# Altium project TestServoCircuit.PrjPcb
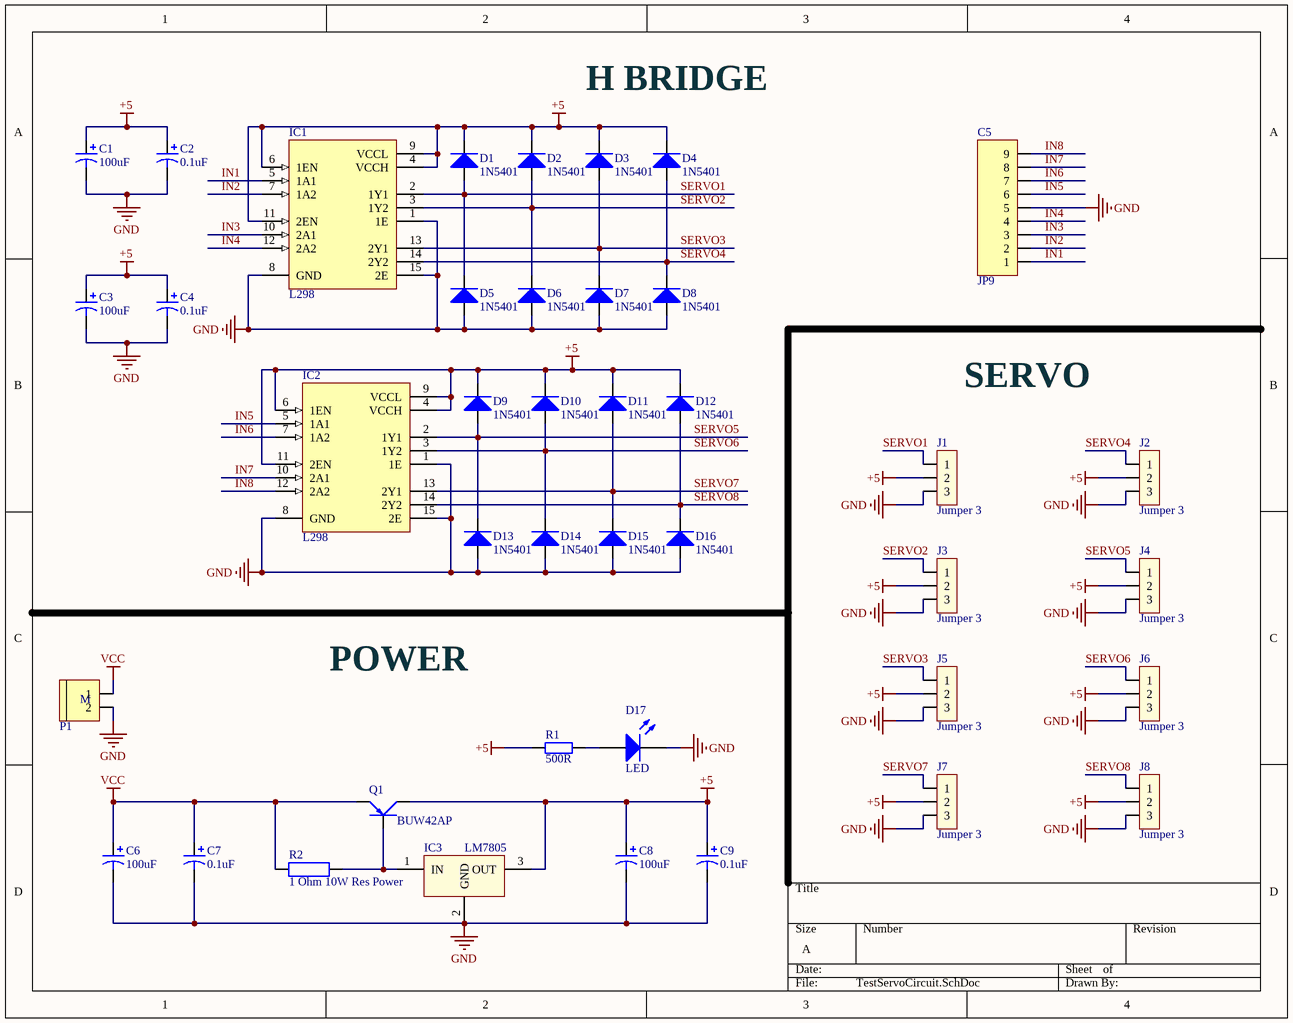
[diagram p0: TestServoCircuit.SchDoc]
1 sheet, 41 parts. Net scope: global (net labels, ports and power ports of the same name join across sheets).
Board file: TestServoCircuit.PcbDoc

## Sheet TestServoCircuit.SchDoc
size A; SheetNumber: 1; SheetTotal: 1

### Parts
C1  value 100uF  [CAPPR3-8x12]  (hidden comment: Cap Polar)
C2  value 0.1uF  [CAPPR2-5x11]  (hidden comment: Cap Polar)
C3  value 100uF  [CAPPR3-8x12]  (hidden comment: Cap Polar)
C4  value 0.1uF  [CAPPR2-5x11]  (hidden comment: Cap Polar)
C5  JP9  [JP9-D1T]
C6  value 100uF  [CAPPR3-8x12]  (hidden comment: Cap Polar)
C7  value 0.1uF  [CAPPR2-5x11]  (hidden comment: Cap Polar)
C8  value 100uF  [CAPPR3-8x12]  (hidden comment: Cap Polar)
C9  value 0.1uF  [CAPPR2-5x11]  (hidden comment: Cap Polar)
D1  1N5401  [DIODE/POW/3A]
D2  1N5401  [DIODE/POW/3A]
D3  1N5401  [DIODE/POW/3A]
D4  1N5401  [DIODE/POW/3A]
D5  1N5401  [DIODE/POW/3A]
D6  1N5401  [DIODE/POW/3A]
D7  1N5401  [DIODE/POW/3A]
D8  1N5401  [DIODE/POW/3A]
D9  1N5401  [DIODE/POW/3A]
D10  1N5401  [DIODE/POW/3A]
D11  1N5401  [DIODE/POW/3A]
D12  1N5401  [DIODE/POW/3A]
D13  1N5401  [DIODE/POW/3A]
D14  1N5401  [DIODE/POW/3A]
D15  1N5401  [DIODE/POW/3A]
D16  1N5401  [DIODE/POW/3A]
D17  LED  [LED_5mm]
IC1  L298  [DIP15SL2]
IC2  L298  [DIP15SL2]
IC3  LM7805  [QTO-220]
J1  Jumper 3  [JP3]
J2  Jumper 3  [JP3]
J3  Jumper 3  [JP3]
J4  Jumper 3  [JP3]
J5  Jumper 3  [JP3]
J6  Jumper 3  [JP3]
J7  Jumper 3  [JP3]
J8  Jumper 3  [JP3]
P1  KF301 Domino 2  [Header 2 - M]  (value not drawn)
Q1  BUW42AP  [TO-3P]
R1  value 500R  [DIEN TRO 1/4 W]  (hidden comment: R0.4W)
R2  1 Ohm 10W Res Power  [DIEN TRO 10W]

### Nets
+5: C1.1 C2.1 C3.1 C4.1 C8.1 C9.1 D1.2(K) D2.2(K) D3.2(K) D4.2(K) D9.2(K) D10.2(K) D11.2(K) D12.2(K) IC1.4(VCCH) IC1.6(1EN) IC1.9(VCCL) IC1.11(2EN) IC2.4(VCCH) IC2.6(1EN) IC2.9(VCCL) IC2.11(2EN) IC3.3(OUT) J1.2 J2.2 J3.2 J4.2 J5.2 J6.2 J7.2 J8.2 Q1.2(C) R1.1
GND: C1.2 C2.2 C3.2 C4.2 C5.5 C6.2 C7.2 C8.2 C9.2 D5.1(A) D6.1(A) D7.1(A) D8.1(A) D13.1(A) D14.1(A) D15.1(A) D16.1(A) D17.2(K) IC1.1(1E) IC1.8(GND) IC1.15(2E) IC2.1(1E) IC2.8(GND) IC2.15(2E) IC3.2(GND) J1.3 J2.3 J3.3 J4.3 J5.3 J6.3 J7.3 J8.3 P1.2
VCC: C6.1 C7.1 P1.1 Q1.3(E) R2.1
IN1: C5.1 IC1.5(1A1)
IN2: C5.2 IC1.7(1A2)
IN3: C5.3 IC1.10(2A1)
IN4: C5.4 IC1.12(2A2)
IN5: C5.6 IC2.5(1A1)
IN6: C5.7 IC2.7(1A2)
IN7: C5.8 IC2.10(2A1)
IN8: C5.9 IC2.12(2A2)
SERVO1: D1.1(A) D5.2(K) IC1.2(1Y1) J1.1
SERVO2: D2.1(A) D6.2(K) IC1.3(1Y2) J3.1
SERVO3: D3.1(A) D7.2(K) IC1.13(2Y1) J5.1
SERVO4: D4.1(A) D8.2(K) IC1.14(2Y2) J2.1
SERVO5: D9.1(A) D13.2(K) IC2.2(1Y1) J4.1
SERVO6: D10.1(A) D14.2(K) IC2.3(1Y2) J6.1
SERVO7: D11.1(A) D15.2(K) IC2.13(2Y1) J7.1
SERVO8: D12.1(A) D16.2(K) IC2.14(2Y2) J8.1
NetD17_1: D17.1(A) R1.2
NetIC3_1: IC3.1(IN) Q1.1(B) R2.2

### Notes on the sheet
- H BRIDGE
- SERVO
- POWER
- (in symbol HEADER 2 - M) M

### Library data of the parts
C1-C4 C6-C9 = Cap Polar: Polarized Capacitor; Published: 8-Jun-2000; LatestRevisionDate: 17-Jul-2002; LatestRevisionNote: Re-released for DXP Platform.; PackageReference: POLAR0.8; Publisher: Altium Limited
C5 = JP9: WR-PHD 2.54 mm Angled Socket Header; Manufacturer: W¨¹rth Elektronik eiSos GmbH; partNo: 613009143121; ComponentLink1 Description: Manufacturer; ComponentLink2 Description: Datasheet; NoPins: 09; Created Date: 29 March 2013; ComponentLink1URL: http://www.we-online.com; ComponentLink2URL: http://katalog.we-online.de/em/datasheet/6130xx143121.pdf; Created by: Karrer Zheng
D1-D16 = Diode: Default Diode; Published: 8-Jun-2000; LatestRevisionDate: 17-Jul-2002; LatestRevisionNote: Re-released for DXP Platform.; PackageVersion: Sep-1996; PackageReference: SMC; Publisher: Altium Limited; Code_JEDEC: DO-214-AB
D17 = LED: Typical INFRARED GaAs LED; Published: 8-Jun-2000; LatestRevisionDate: 08-Jul-2005; LatestRevisionNote: Mech Layer 1 removed.; PackageReference: LED-0; Publisher: Altium Limited
IC1 IC2 = L298: Dual Full-H Driver; Note: The tab is elec is connected to GND pin; Published: 15-May-2002; DatasheetVersion: Jun-1990; PackageReference: KV015; Publisher: Altium Limited; PackageDescription: TO, Thru-Hole, Vertical, Heatsink Mounted; 15 Bent Staggered Leads; Pitch 1.27 mm; ComponentLink1Description: Manufacturer Link; ComponentLink1URL: http://www.ti.com/
IC3 = LM78xx: On ap +, from + 5 to + 24VDC; Value: LM7805
J1-J8 = JP3: Value: J3
P1 = HEADER 2 - M: TERM BLOCK PLUG 2POS 5MM; Manufacturer: On-Shore Technology; Number of Positions: 2; Number of Levels: 1; Current: 10A; Voltage: 300V; Pitch: 0.197inch; Wire Gauge (Max): 22AWG; Wire Gauge (Min): 14AWG; Supplier 1: Digi-Key; Manufacturer Part Number: KF301; RoHS: No; Category: Terminal Blocks; Stock 1: 2267; Mount: Free Hanging; Number of Pins: 2; Color: Blue; Housing Color: Blue; Contact Plating: Tin; Min Operating Temperature: -30°C; Max Operating Temperature: 105°C; Packaging: Bulk; Number of Positions Per Level: 2; Termination: Screw; Number of Rows: 1; Series: KF301; Length: 7.7MM; Width: 10MM; Height: 10mm; ComponentLink1URL: http://www.on-shore.com/wp-content/uploads/2015/09/ed130ds.pdf?src-supplier=Digi-Key; ComponentLink1Description: http://www.on-shore.com/wp-content/uploads/2015/09/ed130ds.pdf?src-supplier=Digi-Key
Q1 = PNP_BCE
R1 = Res 1/4 W: Resistor; Published: 8-Jun-2000; LatestRevisionDate: 17-Jul-2002; LatestRevisionNote: Re-released for DXP Platform.; PackageReference: AXIAL-0.4; Publisher: Altium Limited
R2 = Res 10 W: 10W Res Power; Creator: Nguyen Ba Bien